# EasyEDA schematic SCH_ECE198-02.json
TITLE: Automatic-Garden; REV: 0.2; Date: 2022-10-26; Sheet: 1/1; Drawn By: Damir Gazizullin; Company: University of Waterloo
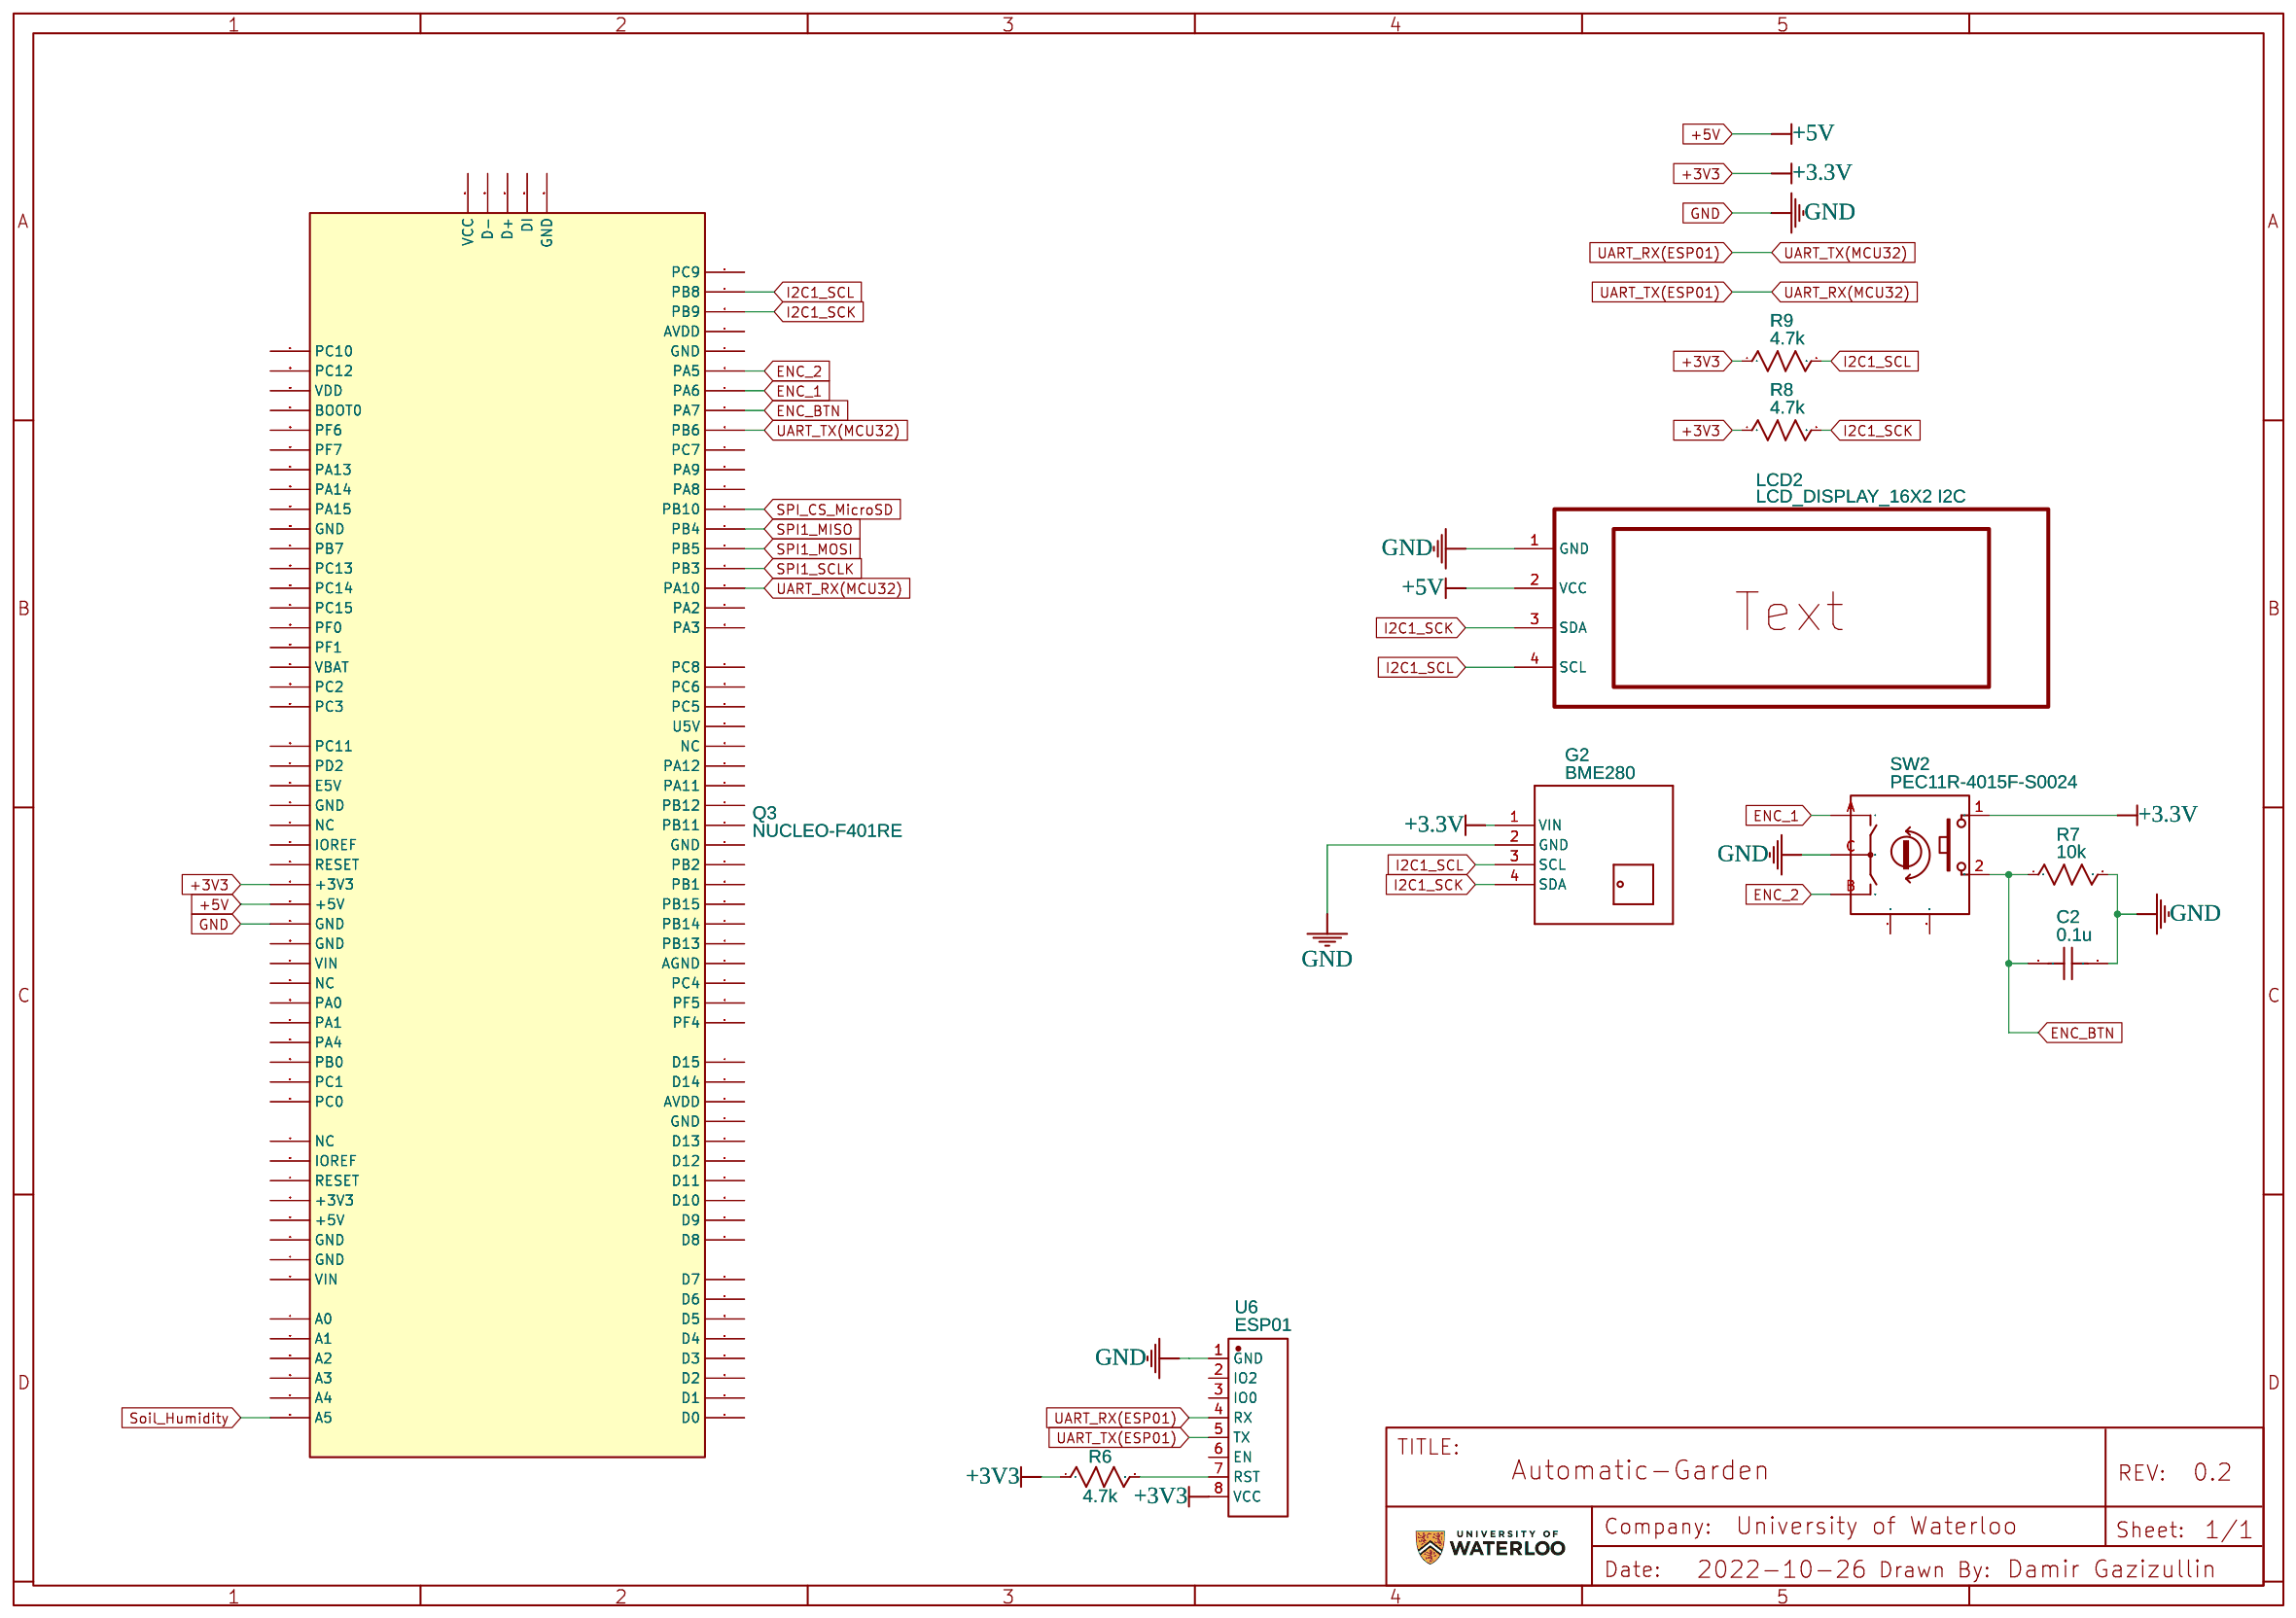
[diagram p0: schematic sheet]

## Parts
C2  0.1u  [C0603]
G2  BME280  [TEMP-HUM-PRES-BME280]
LCD2  LCD_DISPLAY_16X2 I2C  [LCD_2004_4-8BIT_IF LCD_2004_4-8BIT_IF V4 I2C]
Q3  NUCLEO-F401RE  [ARDUINOR3-NOTEXT-NOIOREF]
R6  4.7k  [R_AXIAL-0.5]
R7  10k  [R_AXIAL-0.5]
R8  4.7k  [R0603]
R9  4.7k  [R0603]
SW2  PEC11R-4015F-S0024  [SW-TH_PEC11R-4XXXF-SXXXX]
U6  ESP01  [ESP01]

## Library data of the parts
C2 = C_0603_US: Contributor: LCEDA_Lib
G2 = TEMP-HUM-PRES-BME280: Contributor: Azias
LCD2 = LCD_DISPLAY_16X2 I2C: sourceId: yDLFXRL3l; 15: A; Contributor: trailescu andreea
Q3 = NUCLEO-F401RE
R6 R7 = R_AXIAL-0.5_US: Contributor: LCEDA_Lib
R8 R9 = R_0603_US: Contributor: LCEDA_Lib
SW2 = PEC11R-4015F-S0024: Supplier: LCSC; Supplier Part: C143789; Manufacturer: BOURNS; Contributor: LCSC; JLCPCB Part Class: Extended Part
U6 = ESP01: Contributor: luisfbarba

## Nets
+3.3V: G2.1(VIN) Q3.91(+3V3) R6.1 R8.1 R9.1 SW2.1 U6.8(VCC)
+5V: LCD2.2(VCC) Q3.90(+5V)
GND: C2.2 G2.2(GND) LCD2.1(GND) Q3.89(GND) R7.2 SW2.C U6.1(GND)
ENC_1: Q3.14(PA6) SW2.A
ENC_2: Q3.13(PA5) SW2.B
ENC_BTN: C2.1 Q3.15(PA7) R7.1 SW2.2
I2C1_SCK: G2.4(SDA) LCD2.3(SDA) Q3.10(PB9) R8.2
I2C1_SCL: G2.3(SCL) LCD2.4(SCL) Q3.9(PB8) R9.2
Soil_Humidity: Q3.66(A5)
SPI1_MISO: Q3.21(PB4)
SPI1_MOSI: Q3.22(PB5)
SPI1_SCLK: Q3.23(PB3)
SPI_CS_MicroSD: Q3.20(PB10)
UART_RX(ESP01): Q3.16(PB6) U6.4(RX)
UART_RX(MCU32): Q3.24(PA10) U6.5(TX)
Net-(R6-2): R6.2 U6.7(RST)

Not connected (* = marked no-connect by the designer): Q3 8(PC9) 11(AVDD) 12(GND) 17(PC7) 18(PA9) 19(PA8) 25(PA2) 26(PA3) 28(PC8) 29(PC6) 30(PC5) 31(U5V) 32(NC) 33(PA12) 34(PA11) 35(PB12) 36(PB11) 37(GND) 38(PB2) 39(PB1) 40(PB15) 41(PB14) 42(PB13) 43(AGND) 44(PC4) 45(PF5) 46(PF4) 47(D15) 48(D14) 49(AVDD) 50(GND) 51(D13) 52(D12) 53(D11) 54(D10) 55(D9) 56(D8) 58(D7) 59(D6) 60(D5) 61(D4) 62(D3) 63(D2) 64(D1) 65(D0) 67(A4) 68(A3) 69(A2) 70(A1) 71(A0) 72(VIN) 73(GND) 74(GND) 75(+5V) 76(+3V3) 77(RESET) 78(IOREF) 79(NC) 80(PC0) 81(PC1) 82(PB0) 83(PA4) 84(PA1) 85(PA0) 86(NC) 87(VIN) 88(GND) 92(RESET) 93(IOREF) 94(NC) 95(GND) 96(E5V) 97(PD2) 98(PC11) 99(PC3) 100(PC2) 101(VBAT) 102(PF1) 103(PF0) 104(PC15) 105(PC14) 106(PC13) 107(PB7) 108(GND) 109(PA15) 110(PA14) 111(PA13) 112(PF7) 113(PF6) 114(BOOT0) 115(VDD) 116(PC12) 117(PC10) 118(GND); SW2 MT1 MT2; U6 2(IO2) 3(IO0) 6(EN)
